# EAGLE schematic Data Recovery (EAGLE 7.4.0)
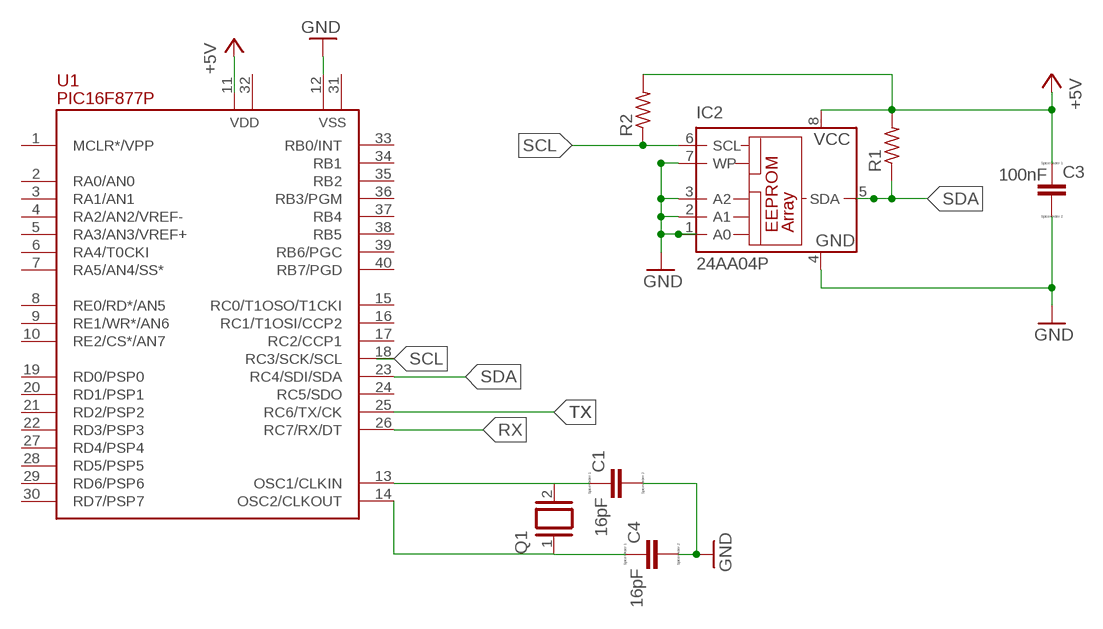
[diagram p0: schematic, sheet 1]

## Parts
C1  C  [C0805]
C3  C  [C0805]
C4  C  [C0805]
IC2  24AA04P  [DIL8]
Q1  XTAL  [Q]
R1  R-US_0204/2V  [0204V]
R2  R-US_0204/2V  [0204V]
U1  PIC16F877P  [DIL40]

## Nets
+5V: C3.1 IC2.8(VCC) R1.2 R2.2
GND: C1.2 C3.2 C4.2 IC2.1(A0) IC2.2(A1) IC2.3(A2) IC2.4(GND) IC2.7(WP) U1.12(VSS)
N$15: C1.1 Q1.2 U1.13(OSC1/CLKIN)
N$16: C4.1 Q1.1 U1.14(OSC2/CLKOUT)
RX: U1.26(RC7/RX/DT)
SCL: IC2.6(SCL) R2.1
SDA: IC2.5(SDA) R1.1 U1.23(RC4/SDI/SDA)
TX: U1.25(RC6/TX/CK)
Unconnected: U1.1(MCLR*/VPP) U1.2(RA0/AN0) U1.3(RA1/AN1) U1.4(RA2/AN2/VREF-) U1.5(RA3/AN3/VREF+) U1.6(RA4/T0CKI) U1.7(RA5/AN4/SS*) U1.8(RE0/RD*/AN5) U1.9(RE1/WR*/AN6) U1.10(RE2/CS*/AN7) U1.11(VDD) U1.15(RC0/T1OSO/T1CKI) U1.16(RC1/T1OSI/CCP2) U1.17(RC2/CCP1) U1.18(RC3/SCK/SCL) U1.19(RD0/PSP0) U1.20(RD1/PSP1) U1.21(RD2/PSP2) U1.22(RD3/PSP3) U1.24(RC5/SDO) U1.27(RD4/PSP4) U1.28(RD5/PSP5) U1.29(RD6/PSP6) U1.30(RD7/PSP7) U1.31(VSS) U1.32(VDD) U1.33(RB0/INT) U1.34(RB1) U1.35(RB2) U1.36(RB3/PGM) U1.37(RB4) U1.38(RB5) U1.39(RB6/PGC) U1.40(RB7/PGD)

## Library data of the parts
C1 C4 = eagle-ltspice:C: CAPACITOR, European symbol; SPICEMODEL: 16pF; SPICEPREFIX: C
C3 = eagle-ltspice:C: CAPACITOR, European symbol; SPICEMODEL: 100nF; SPICEPREFIX: C
IC2 = microchip:24*: Serial EEPROM I2C; MPN: 24AA04-I/P; OC_FARNELL: 1331275; OC_NEWARK: 35M0696
Q1 = special:XTAL: CRYSTAL
R1 R2 = resistor:R-US_: RESISTOR, American symbol
U1 = pic16f87x:PIC16F877: FLASH MICROCONTROLLER